# Altium schematic sheet Interface.SchDoc
size 289 x 180 mm; ApprovedBy: TTN; DocumentNumber: 2; SheetNumber: 2; SheetTotal: 3
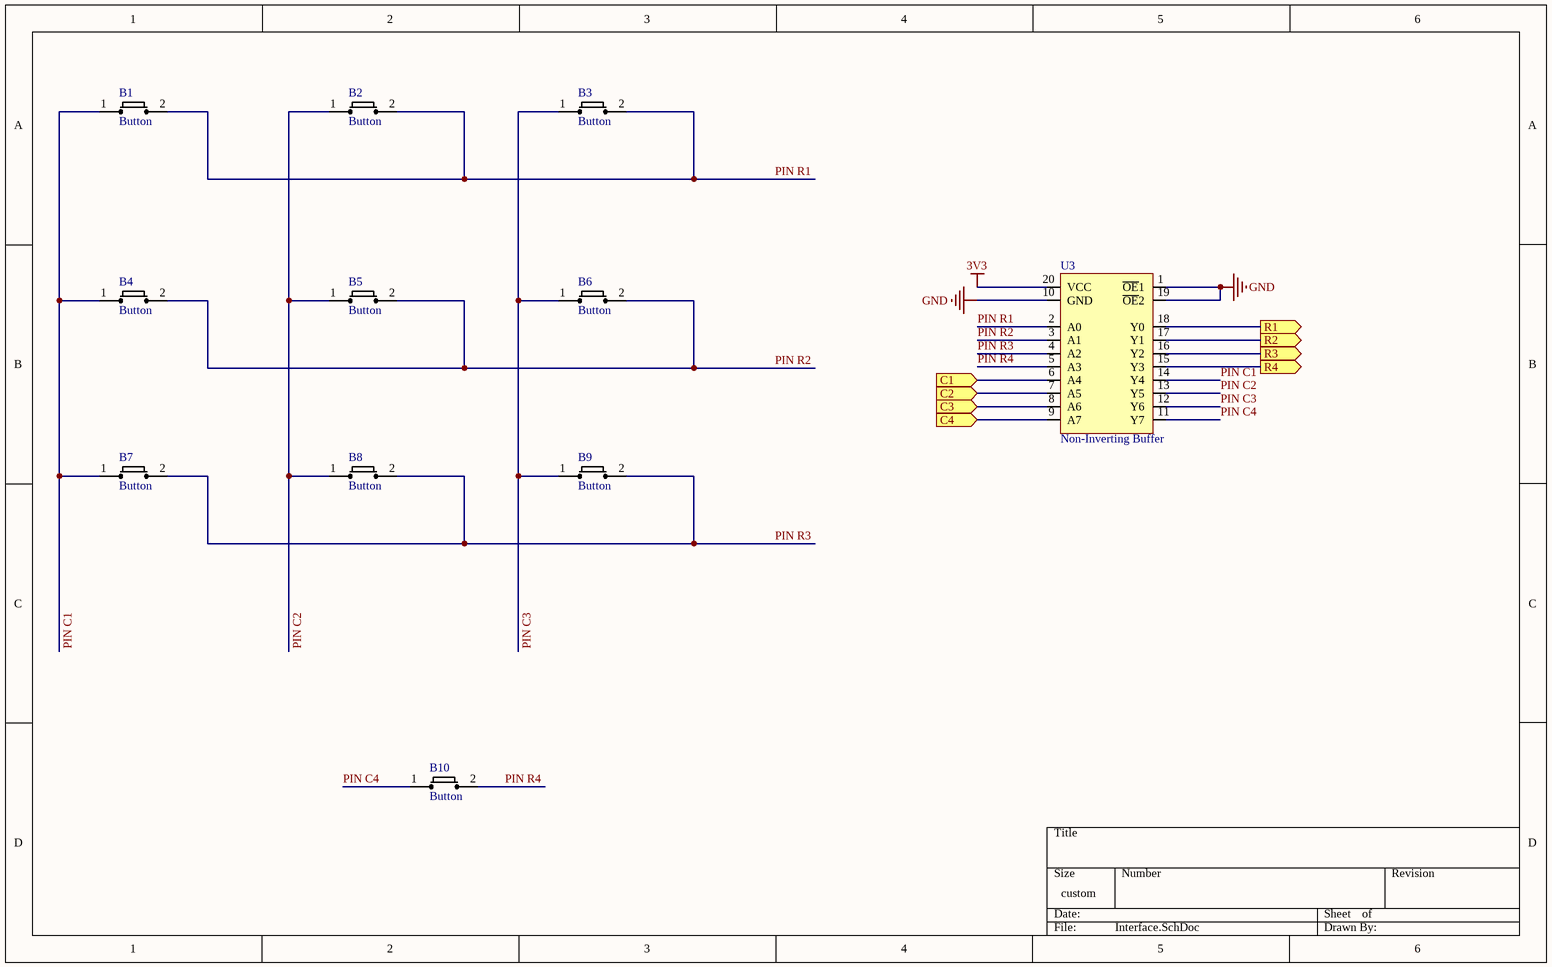
[diagram p0: Interface.SchDoc]

## Parts
B1  Button  [BUTTON_B3F_SMD]
B2  Button  [BUTTON_B3F_SMD]
B3  Button  [BUTTON_B3F_SMD]
B4  Button  [BUTTON_B3F_SMD]
B5  Button  [BUTTON_B3F_SMD]
B6  Button  [BUTTON_B3F_SMD]
B7  Button  [BUTTON_B3F_SMD]
B8  Button  [BUTTON_B3F_SMD]
B9  Button  [BUTTON_B3F_SMD]
B10  Button  [BUTTON_B3F_SMD]
U3  Non-Inverting Buffer  [DIP_20]

## Ports
C1 (in), C2 (in), C3 (in), C4 (in), R1 (out), R2 (out), R3 (out), R4 (out)

## Nets
3V3: U3.20(VCC)
GND: U3.1(~{OE}1) U3.10(GND) U3.19(~{OE}2)
C1: U3.6(A4) ; port C1
C2: U3.7(A5) ; port C2
C3: U3.8(A6) ; port C3
C4: U3.9(A7) ; port C4
PIN C1: B1.1 B4.1 B7.1 U3.14(Y4)
PIN C2: B2.1 B5.1 B8.1 U3.13(Y5)
PIN C3: B3.1 B6.1 B9.1 U3.12(Y6)
PIN C4: B10.1 U3.11(Y7)
PIN R1: B1.2 B2.2 B3.2 U3.2(A0)
PIN R2: B4.2 B5.2 B6.2 U3.3(A1)
PIN R3: B7.2 B8.2 B9.2 U3.4(A2)
PIN R4: B10.2 U3.5(A3)
R1: U3.18(Y0) ; port R1
R2: U3.17(Y1) ; port R2
R3: U3.16(Y2) ; port R3
R4: U3.15(Y3) ; port R4

## Library data of the parts
B1-B10 = Button: 6x6mm, TH, 2 Pins
U3 = 74HC541